# EAGLE design Power Supply 3.3V (EAGLE 7.2.0)
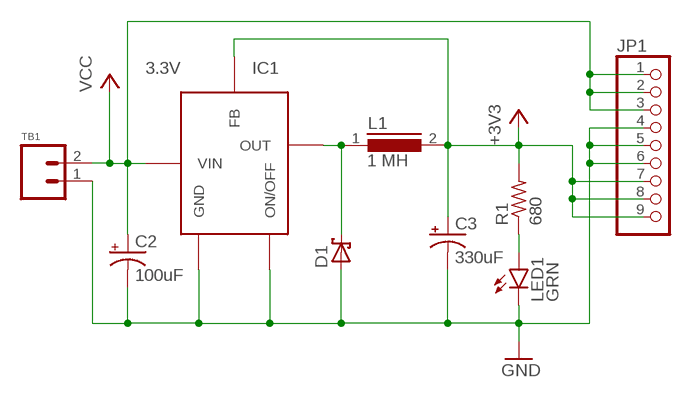
[diagram p0: schematic, sheet 1]

## Parts
C2  100uF  CAP_POLF  [F_CAP]
C3  330uF  CAP_POLF  [F_CAP]
D1  SCHOTTKY_DIODE  [SMD_DIODE]
IC1  3.3V  TL2575  [TO-263-5]
JP1  PINHD-1X9  [1X09]
L1  1 MH  DR125  [DR125]
LED1  GRN  LED0603  [0603_LED]
R1  680  RESISTOR0603  [0603_RESISTOR]
TB1  TERMINAL_BLOCK_2  [TERMINAL_BLOCK_2]

## Nets
+3V3: C3.+ IC1.4(FB) JP1.7 JP1.8 JP1.9 L1.2 R1.2
GND: C2.- C3.- D1.A IC1.3(GND) IC1.5(ON/OFF) JP1.4 JP1.5 JP1.6 LED1.C TB1.1
N$32: D1.C IC1.2(OUT) L1.1
N$38: LED1.A R1.1
VCC: C2.+ IC1.1(VIN) JP1.1 JP1.2 JP1.3 TB1.2

## Library data of the parts
C2 C3 = jkf:CAP_POL
D1 = jkf:SCHOTTKY_DIODE; DIGIKEY#: 1N5819HW-FDICT-ND; MANF: Diodes Inc; MANF#: 1N5819HW-7-F
IC1 = jkf:TL2575; DIGIKEY#: 296-21828-1-ND; MANF: Texas Instruments; MANF#: TL2575-33IKTTR
JP1 = pinhead:PINHD-1X9: PIN HEADER
L1 = jkf:DR125; DIGIKEY#: SRR1208-102KLCT-ND; MANF: Bourns Inc.; MANF#: SRR1208-102KL
LED1 = jkf:LED; DIGIKEY#: 516-2493-1-ND; MANF: Avago Technologies; MANF#: HSMG-C191
R1 = jkf:RESISTOR
TB1 = jkf:TERMINAL_BLOCK_2; DIGIKEY#: 277-2072-1-ND; MANF: Phoenix; MANF#: 1771091

## Board
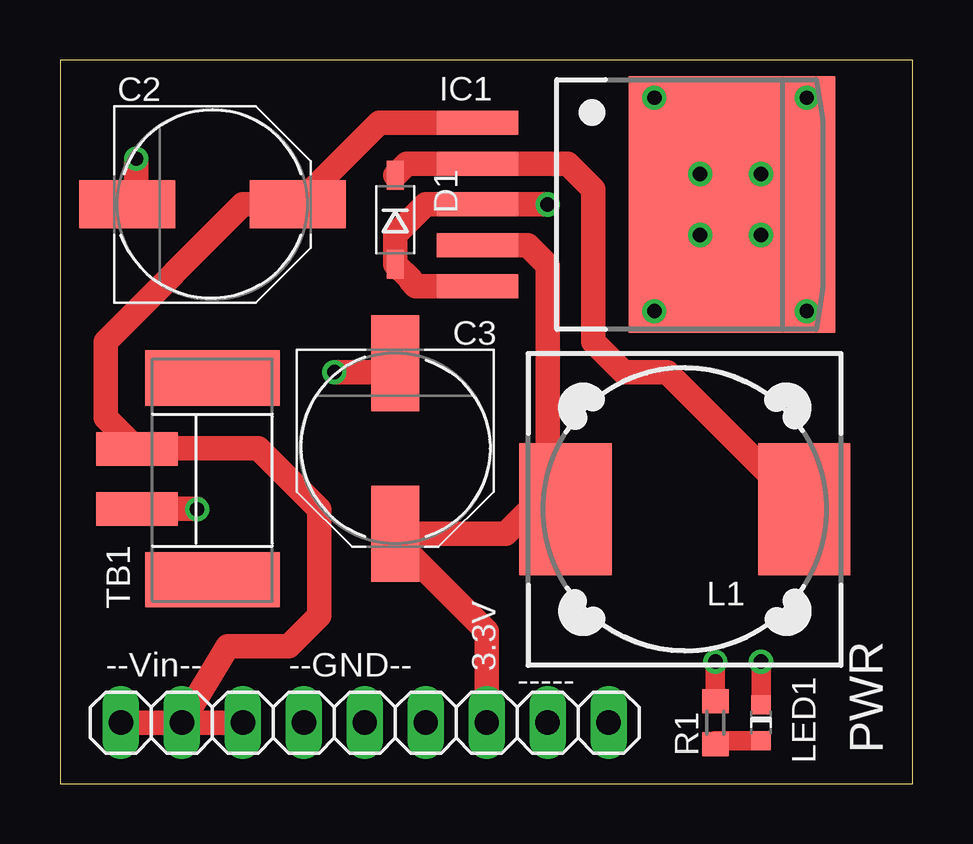
[diagram p1: board, top side]
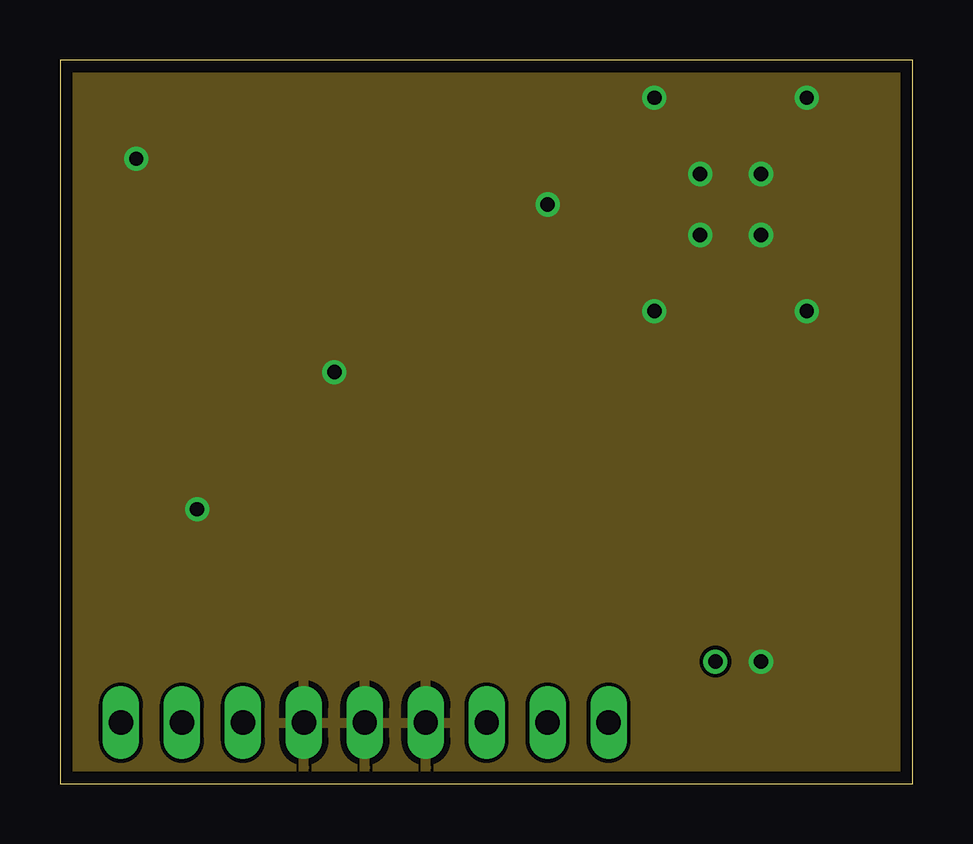
[diagram p2: board, inner layer GND]
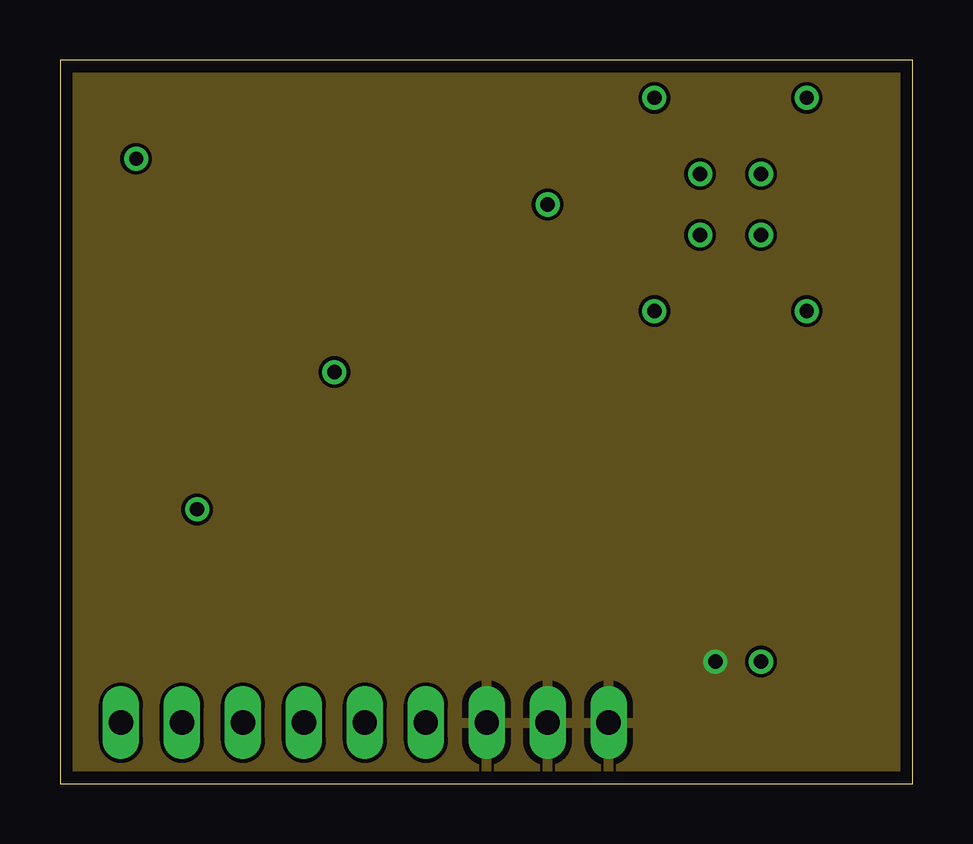
[diagram p3: board, inner layer +3V3]

Size 35.54 x 30.15 mm. Coordinates in mm from the lower left corner, seen from the top.
Outline: 0,0 35.54,0 35.54,30.15 0,30.15 0,0
Copper layers (1+2*15+16): Top 0.0178mm / dielectric 12mil / GND 0.0356mm / dielectric 28mil / +3V3 0.0356mm / dielectric 12mil / Bottom 0.0178mm
Design rules "SSC-EAGLE-4Lyr_v1.0.0.3": minimum track width 6mil, minimum drill 8mil, track to track 6mil, track to pad 6mil, pad to pad 6mil, via to via 6mil, smd to smd 6mil, copper to edge 20mil, drill to drill 16mil, minimum pad ring 8mil, minimum via ring 8mil, stop-mask expansion 3mil, vias tented up to drill 0mil, thermal gap 10mil

### Footprints (pad centres in the part's own frame; a part is rotated, then mirrored left to right if it is on the bottom)
F_CAP = smd 4 x 2: + 3.55,0; - -3.55,0
SMD_DIODE = smd 1.2 x 0.7: A 1.85,0; C -1.85,0
TO-263-5 = smd 1 x 3.4: 1 -3.4,-8; 2 -1.7,-8; 3 0,-8; 4 1.7,-8; 5 3.4,-8 | smd 10.7 x 8.6: TAB 0,2.6
1X09 = drill 1.016 long: 1 -10.16,0; 2 -7.62,0; 3 -5.08,0; 4 -2.54,0; 5 0,0; 6 2.54,0; 7 5.08,0; 8 7.62,0; 9 10.16,0
DR125 = smd 3.85 x 5.5: 1 -4.975,0; 2 4.975,0
0603_LED = smd 0.8 x 0.8: A 0.75,0; C -0.75,0
0603_RESISTOR = smd 1 x 1.1: 1 -0.9,0; 2 0.9,0
TERMINAL_BLOCK_2 = smd 1.4 x 3.4: 1 1.25,-3.15; 2 -1.25,-3.15 | smd 2.3 x 5.6: P$1 4.2,0; P$2 -4.2,0

### Placement (x,y rotation side)
C2  6.35,24.13 0 top
C3  13.97,13.97 270 top
D1  13.97,23.5 270 top
IC1  25.4,24.13 270 top
JP1  12.7,2.54 0 top
L1  26.04,11.43 180 top
LED1  29.21,2.54 270 top
R1  27.3,2.54 90 top
TB1  6.35,12.7 270 top

### Tracks (layer width: path | path; a pad name or v marks a point on that pad's centre or on a via)
+3V3  (via drill 0.6)
  Top 0.813: R1.2 v27.3,5.08
  Top 1.016: L1.2 20.32,12.17 | 20.32,12.17 20.32,21.59 19.48,22.43 IC1.4 | 20.32,12.17 18.57,10.42 C3.+ 13.97,10.16 17.78,6.35 JP1.7
  pour +3V3: 0,30.48 35.56,30.48 35.56,0 0,0
GND  (via drill 0.6)
  Top 0.813: LED1.C v29.21,5.08
  Top 1.016: IC1.5 14.83,20.73 14.61,20.95 14.61,21.01 D1.A 13.97,22.86 15.24,24.13 IC1.3 v20.32,24.13 | C3.- 12.96,17.14 v11.43,17.14 | C2.- 3.17,24.5 v3.17,26.04 | TB1.1 5.7,11.45 v5.71,11.43
  other vias: 24.77,28.57 26.67,25.4 26.67,22.86 24.77,19.68 31.11,28.57 29.21,25.4 29.21,22.86 31.11,19.68
  pour GND: 0,30.48 35.56,30.48 35.56,0 0,0
N$32
  Top 1.016: L1.1 25.3,17.14 23.5,17.14 22.23,18.41 22.23,24.77 21.16,25.83 IC1.2 14.46,25.83 D1.C
N$38
  Top 0.813: LED1.A 27.3,1.79 R1.1
VCC
  Top 1.016: IC1.1 13.3,27.53 C2.+ 7.62,24.13 1.91,18.41 1.91,15.24 TB1.2 3.22,13.97 8.26,13.97 10.79,11.43 10.79,6.99 9.53,5.71 6.99,5.71 JP1.2 | JP1.1 JP1.2 | JP1.2 JP1.3

### Text on the board
tNames: 3.3V | --Vin-- | --GND-- | ----- | PWR